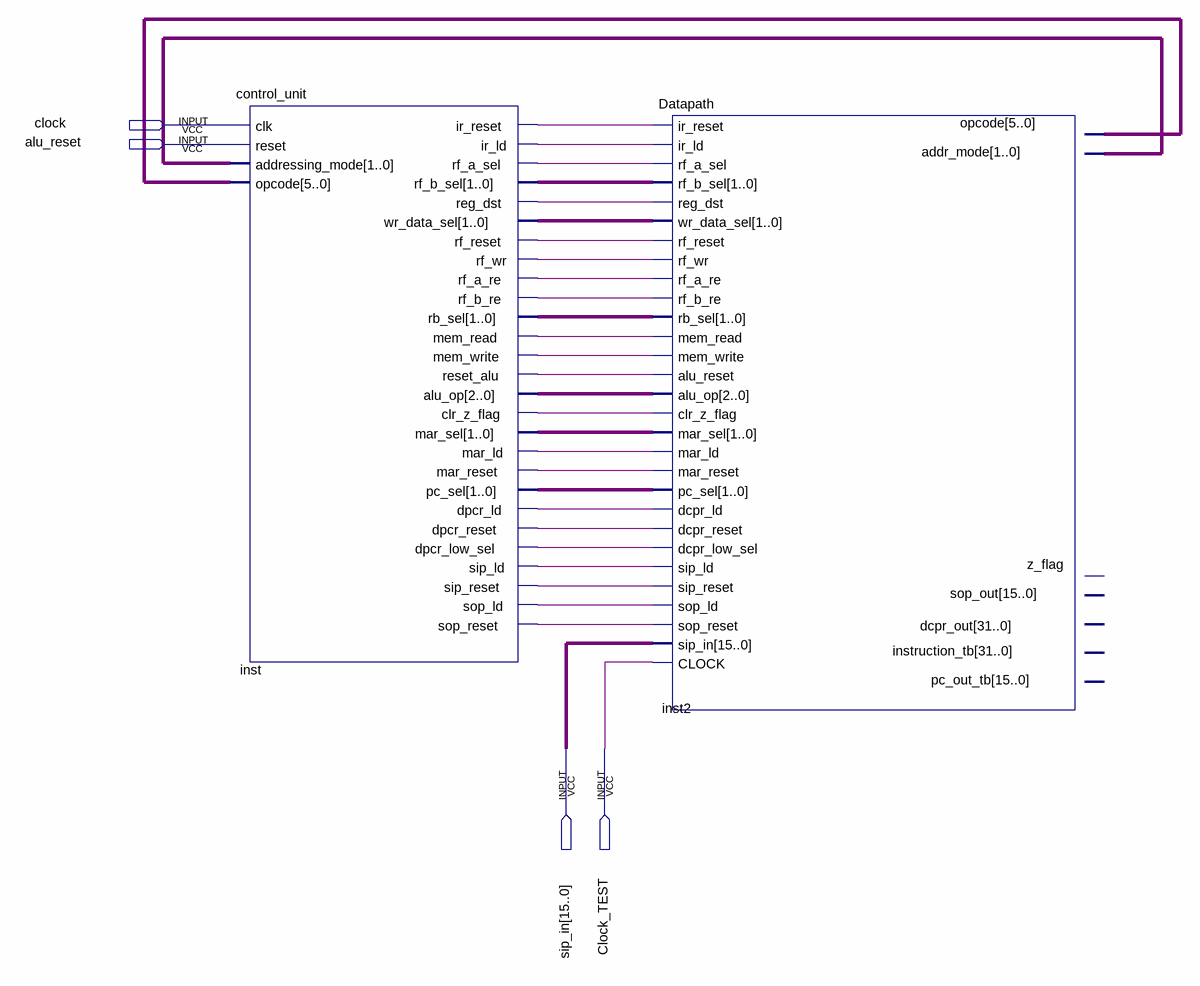
[diagram p0: schematic sheet]
// Quartus schematic ReCOP.bdf as structural Verilog: 2 symbols, 4 pins
module ReCOP (
  input  clock,
  input  alu_reset,
  input  [15:0] sip_in,
  input  Clock_TEST
);

  wire inst_clr_z_flag, inst_dpcr_ld, inst_dpcr_low_sel, inst_dpcr_reset, inst_ir_ld, inst_ir_reset,
       inst_mar_ld, inst_mar_reset, inst_mem_read, inst_mem_write, inst_reg_dst, inst_reset_alu,
       inst_rf_a_re, inst_rf_a_sel, inst_rf_b_re, inst_rf_reset, inst_rf_wr, inst_sip_ld, inst_sip_reset,
       inst_sop_ld, inst_sop_reset;
  wire [1:0] inst2_addr_mode, inst_mar_sel, inst_pc_sel, inst_rb_sel, inst_rf_b_sel, inst_wr_data_sel;
  wire [2:0] inst_alu_op;
  wire [5:0] inst2_opcode;

  control_unit inst (
    .clk(clock), .reset(alu_reset), .addressing_mode(inst2_addr_mode), .opcode(inst2_opcode),
    .ir_reset(inst_ir_reset), .ir_ld(inst_ir_ld), .rf_a_sel(inst_rf_a_sel), .rf_b_sel(inst_rf_b_sel),
    .reg_dst(inst_reg_dst), .wr_data_sel(inst_wr_data_sel), .rf_reset(inst_rf_reset), .rf_wr(inst_rf_wr),
    .rf_a_re(inst_rf_a_re), .rf_b_re(inst_rf_b_re), .rb_sel(inst_rb_sel), .mem_read(inst_mem_read),
    .mem_write(inst_mem_write), .reset_alu(inst_reset_alu), .alu_op(inst_alu_op),
    .clr_z_flag(inst_clr_z_flag), .mar_sel(inst_mar_sel), .mar_ld(inst_mar_ld), .mar_reset(inst_mar_reset),
    .pc_sel(inst_pc_sel), .dpcr_ld(inst_dpcr_ld), .dpcr_reset(inst_dpcr_reset),
    .dpcr_low_sel(inst_dpcr_low_sel), .sip_ld(inst_sip_ld), .sip_reset(inst_sip_reset), .sop_ld(inst_sop_ld),
    .sop_reset(inst_sop_reset));
  Datapath inst2 (
    .CLOCK(Clock_TEST), .dcpr_ld(inst_dpcr_ld), .dcpr_reset(inst_dpcr_reset), .ir_ld(inst_ir_ld),
    .pc_sel(inst_pc_sel), .ir_reset(inst_ir_reset), .dcpr_low_sel(inst_dpcr_low_sel),
    .mem_write(inst_mem_write), .mem_read(inst_mem_read), .mar_sel(inst_mar_sel), .mar_ld(inst_mar_ld),
    .rf_reset(inst_rf_reset), .rf_wr(inst_rf_wr), .rf_a_re(inst_rf_a_re), .rf_b_re(inst_rf_b_re),
    .mar_reset(inst_mar_reset), .sop_reset(inst_sop_reset), .sop_ld(inst_sop_ld), .alu_reset(inst_reset_alu),
    .rf_a_sel(inst_rf_a_sel), .rb_sel(inst_rb_sel), .alu_op(inst_alu_op), .rf_b_sel(inst_rf_b_sel),
    .clr_z_flag(inst_clr_z_flag), .reg_dst(inst_reg_dst), .sip_reset(inst_sip_reset),
    .wr_data_sel(inst_wr_data_sel), .sip_ld(inst_sip_ld), .sip_in(sip_in), .addr_mode(inst2_addr_mode),
    .opcode(inst2_opcode));  // open: pc_out_tb, dcpr_out, instruction_tb, sop_out, z_flag
endmodule
